# EAGLE design Aussensensor_v1.5 (EAGLE 6.6.0)
Assembly variants: AVR TH/P/L, AVR P/L, AVR L
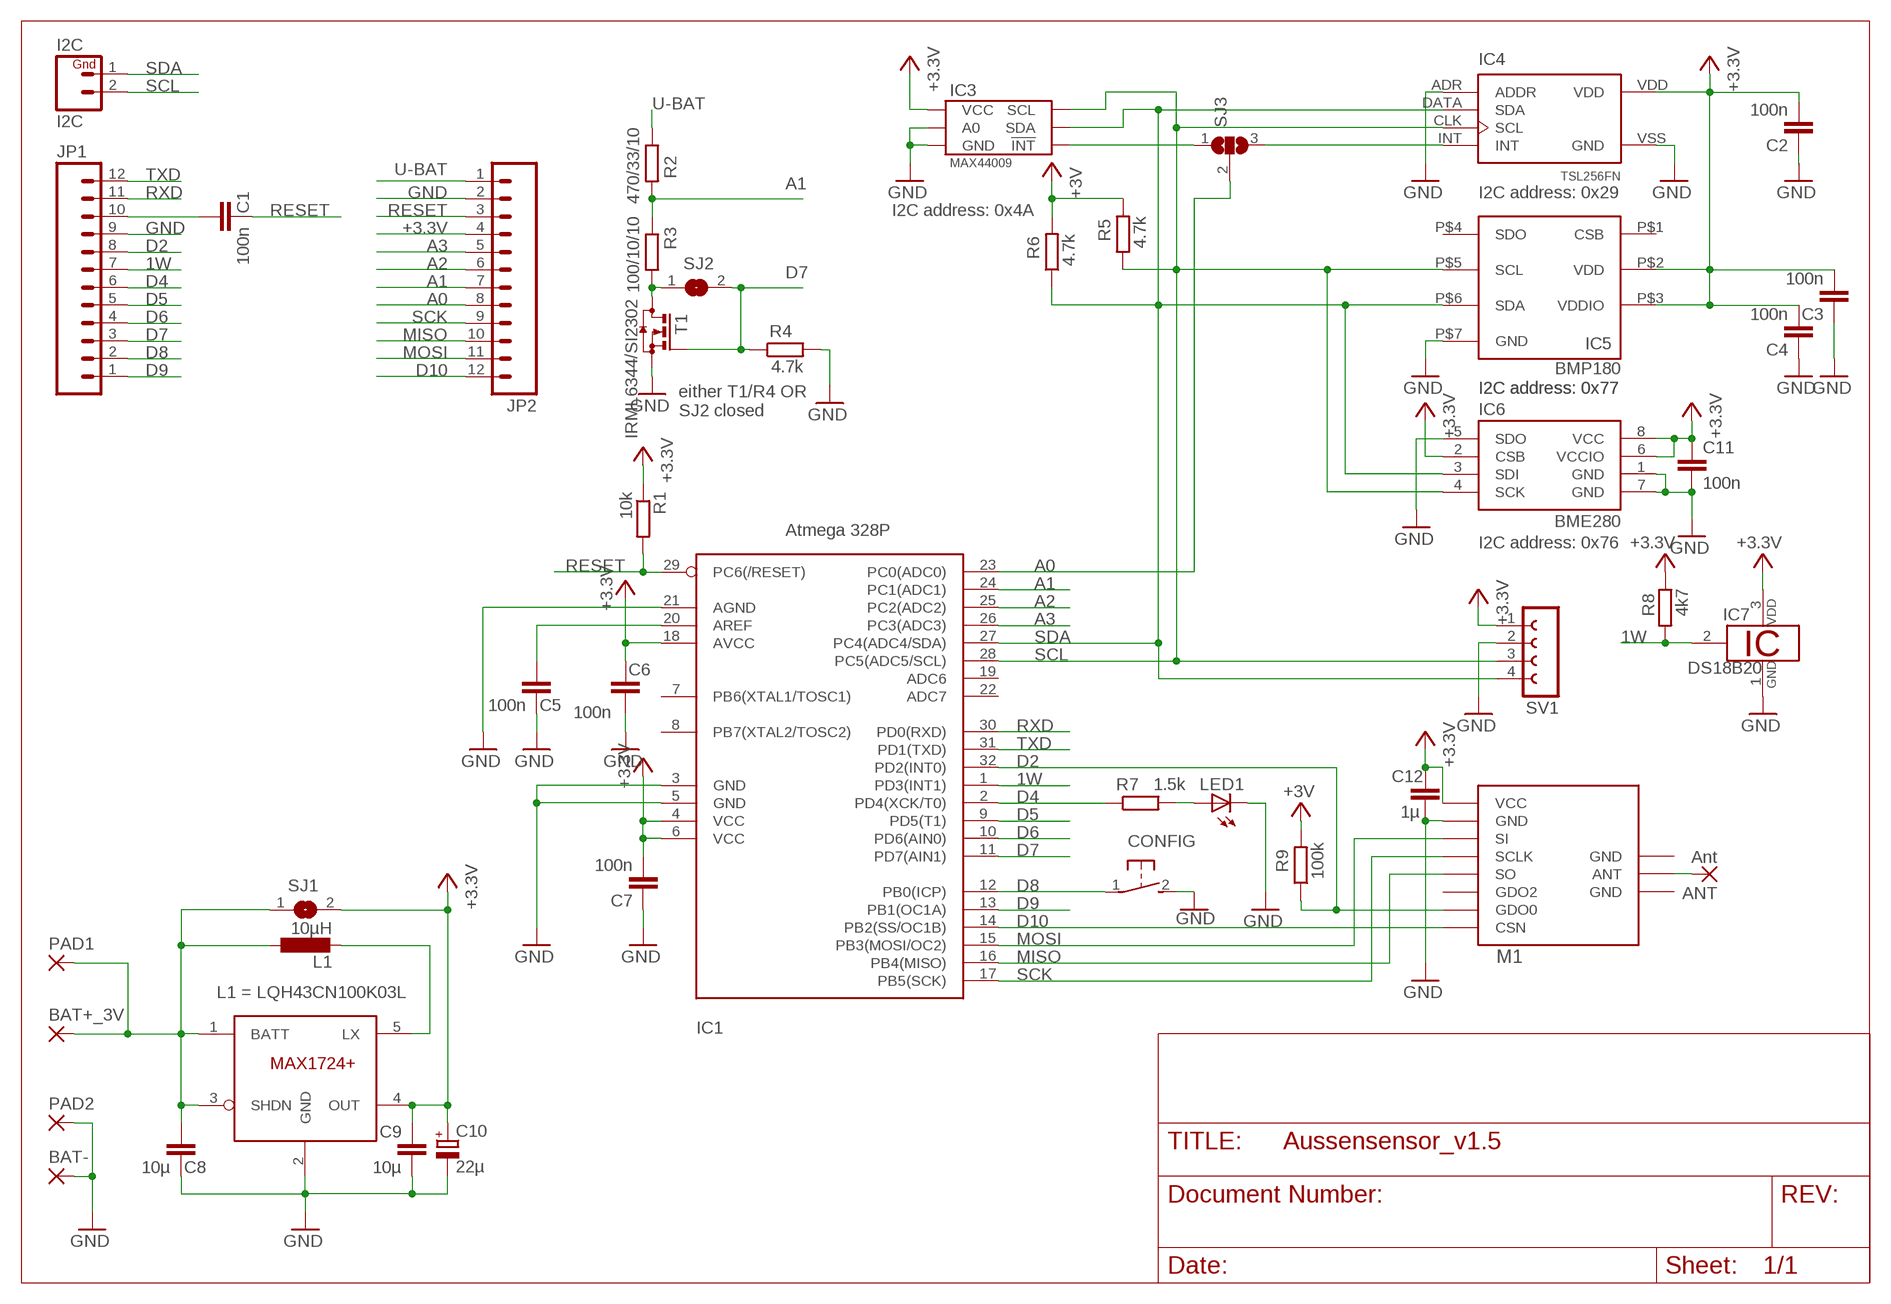
[diagram p0: schematic, sheet 1]

## Parts
ANT  Ant  1,6/0,8  [1,6/0,8]
BAT+_3V  1,6/0,9  [1,6/0,9]
BAT-  1,6/0,9  [1,6/0,9]
C1  100n  C-EUC0805  [C0805]
C2  100n  C-EUC0805  [C0805]
C3  100n  C-EUC0805  [C0805]  (not fitted in variant AVR L)
C4  100n  C-EUC0805  [C0805]  (not fitted in variant AVR L)
C5  100n  C-EUC0805  [C0805]
C6  100n  C-EUC0805  [C0805]
C7  100n  C-EUC0805  [C0805]
C8  10µ  C-EUC1206  [C1206]
C9  10µ  C-EUC1206  [C1206]
C10  22µ  CPOL-EUSMCA  [SMC_A]
C11  100n  C-EUC0805  [C0805]
C12  1µ  C-EUC0805  [C0805]
CONFIG  DTSM-3  [DTSM-3]
I2C  I2C  M02PTH  [1X02]  (not fitted in variant AVR TH/P/L)  (not fitted in variant AVR P/L)  (not fitted in variant AVR L)
IC1  Atmega 328P  MEGA8-AI  [TQFP32-08]
IC2  MAX1724  [SOT23-5L]
IC3  MAX44009  [UTDFN]
IC4  TSL256FN  [TSL256X_FN]
IC5  BMP180  [LGA-7]  (not fitted in variant AVR L)
IC6  BME280  [LGA_8PIN_25X25]
IC7  DS18B20  [TO92-]
JP1  M12PTH  [1X12]  (not fitted in variant AVR TH/P/L)  (not fitted in variant AVR P/L)  (not fitted in variant AVR L)
JP2  M12PTH  [1X12]  (not fitted in variant AVR TH/P/L)  (not fitted in variant AVR P/L)  (not fitted in variant AVR L)
L1  10µH  L-EUL4532P  [L4532P]
LED1  LEDCHIP-LED0805  [CHIP-LED0805]
M1  CC1101_WIRELES_MODULE  [CC1101_WIRELES_MODULE]
PAD1  SMD2  [SMD1,27-2,54]
PAD2  SMD2  [SMD1,27-2,54]
R1  10k  R-EU_M0805  [M0805]
R2  470/33/10  R-EU_M0805  [M0805]
R3  100/10/10  R-EU_M0805  [M0805]
R4  4.7k  R-EU_M0805  [M0805]
R5  4.7k  R-EU_M0805  [M0805]
R6  4.7k  R-EU_M0805  [M0805]
R7  1.5k  R-EU_M0805  [M0805]
R8  4k7  R-EU_M0805  [M0805]
R9  100k  R-EU_M0805  [M0805]
SJ1  SJ  [SJ]
SJ2  SJ  [SJ]
SJ3  SJ2W  [SJ_2]
SV1  FE04-1  [FE04-1]  (not fitted in variant AVR P/L)  (not fitted in variant AVR L)
T1  IRML6344/SI2302  BSS123  [SOT23]

## Nets
1W: IC1.1(PD3(INT1)) IC7.2 JP1.7 R8.2
+3.3V: C2.2 C3.2 C4.2 C6.2 C7.2 C9.2 C10.+ C11.1 C12.1 IC1.4(VCC) IC1.6(VCC) IC1.18(AVCC) IC2.4(OUT) IC3.1(VCC) IC4.VDD IC5.P$2(VDD) IC5.P$3(VDDIO) IC6.2(CSB) IC6.6(VCCIO) IC6.8(VCC) IC7.3 JP2.4 M1.VCC R1.1 R5.2 R6.2 R8.1 R9.2 SJ1.2 SV1.1 ; supply symbol labelled +3V
A0: IC1.23(PC0(ADC0)) JP2.8 SJ3.2
A1: IC1.24(PC1(ADC1)) JP2.7 R2.2 R3.1
A2: IC1.25(PC2(ADC2)) JP2.6
A3: IC1.26(PC3(ADC3)) JP2.5
D2: IC1.32(PD2(INT0)) JP1.8 M1.GDO0 R9.1
D4: IC1.2(PD4(XCK/T0)) JP1.6 R7.1
D5: IC1.9(PD5(T1)) JP1.5
D6: IC1.10(PD6(AIN0)) JP1.4
D7: IC1.11(PD7(AIN1)) JP1.3 R4.1 SJ2.2 T1.1(G)
D8: CONFIG.1 IC1.12(PB0(ICP)) JP1.2
D9: IC1.13(PB1(OC1A)) JP1.1
D10: IC1.14(PB2(SS/OC1B)) JP2.12 M1.CSN
GND: BAT-.1(P) C2.1 C3.1 C4.1 C5.1 C6.1 C7.1 C8.1 C9.1 C10.- C11.2 C12.2 CONFIG.2 IC1.3(GND) IC1.5(GND) IC1.21(AGND) IC2.2(GND) IC3.2(GND) IC3.3(A0) IC3.PAD(GND) IC4.ADR(ADDR) IC4.VSS(GND) IC5.P$7(GND) IC6.1(GND) IC6.5(SDO) IC6.7(GND) IC7.1 JP1.9 JP2.2 LED1.C M1.GND@1(GND) PAD2.1(P) R4.2 SV1.2 T1.2(S)
INT_MAX: IC3.4(!INT) SJ3.1
INT_TSL: IC4.INT SJ3.3
MISO: IC1.16(PB4(MISO)) JP2.10 M1.SO
MOSI: IC1.15(PB3(MOSI/OC2)) JP2.11 M1.SI
N$1: C1.2 JP1.10
N$2: IC2.5(LX) L1.2
N$3: R3.2 SJ2.1 T1.3(D)
N$4: LED1.A R7.2
N$5: ANT.1(P) M1.ANT
N$14: C5.2 IC1.20(AREF)
RESET: C1.1 IC1.29(PC6(/RESET)) JP2.3 R1.2
RXD: IC1.30(PD0(RXD)) JP1.11
SCK: IC1.17(PB5(SCK)) JP2.9 M1.SCLK
SCL: I2C.2 IC1.28(PC5(ADC5/SCL)) IC3.5(SCL) IC4.CLK(SCL) IC5.P$5(SCL) IC6.4(SCK) R5.1 SV1.3
SDA: I2C.1 IC1.27(PC4(ADC4/SDA)) IC3.6(SDA) IC4.DATA(SDA) IC5.P$6(SDA) IC6.3(SDI) R6.1 SV1.4
TXD: IC1.31(PD1(TXD)) JP1.12
U-BAT: BAT+_3V.1(P) C8.2 IC2.1(BATT) IC2.3(SHDN) JP2.1 L1.1 PAD1.1(P) R2.1 SJ1.1
Unconnected: IC1.7(PB6(XTAL1/TOSC1)) IC1.8(PB7(XTAL2/TOSC2)) IC1.19(ADC6) IC1.22(ADC7) IC5.P$1(CSB) IC5.P$4(SDO) M1.GDO2

## Notes on the sheet
- I2C address: 0x29
- I2C address: 0x4A
- either T1/R4 OR
  SJ2 closed
- I2C address: 0x77 | I2C address: 0x77
- I2C address: 0x76
- L1 = LQH43CN100K03L

## Power pins joined to a net without a drawn wire
GND: M1.GND@2(GND) M1.GND@3(GND)

## Library data of the parts
ANT = wirepad:1,6/0,8: THROUGH-HOLE PAD
BAT+_3V BAT- = wirepad:1,6/0,9: THROUGH-HOLE PAD
C1-C9 C11 C12 = rcl:C-EU: CAPACITOR, European symbol
C10 = rcl:CPOL-EU: POLARIZED CAPACITOR, European symbol
CONFIG = switch-tact:DTSM-3
I2C = SparkFun:M02: Header 2 Standard 2-pin 0.1" header. Use with straight break away headers (SKU : PRT-00116), right angle break away headers (PRT-00553), swiss pins (PRT-00743), machine pins (PRT-00117), and female headers (PRT-00115). Molex polarized connector foot print use with SKU : PRT-08233 with associated crimp pins and housings.
IC1 = atmel:MEGA8: MICROCONTROLLER 8 Kbytes FLASH 1 kbytes SRAM 512 bytes EEPROM USART 6-channel 10 bit ADC 2-channel 8 bit ADC
IC2 = MAX1724:MAX1724
IC3 = MAX44009_v6:MAX44009: Maxim Ambient Light Sensor
IC4 = TSL256x:TSL256*: Texas Instruments TSL2560 (SMBus), TSL2561 (I2C) Light-to-digital converter
IC5 = projecttree:BMP180
IC6 = bosch:BME280: Bosch BME280 humidity, temperature and pressure sensor.
IC7 = 1wire_v6:DS18B20: Programmable Resolution Digital Thermometer This chip provides a onewire thermosensor with approx. 0.5°C accuracy. A programmable over/undertemperure alarm is available. The precision can be set from 9..12 bits. Notes: Vdd must be applied for accurate measurements at low temperatures, as the parasite power circuit otherwise heats the sensor. If parasite power is used, Vdd has to be connected to GND. The DS1822 is a low-cost thermometer chip, the DS18S20 is similar to the DS18B20, but with 9 Bit precision only. Author: Jan Kandziora <jjj@gmx.de>
JP1 JP2 = SparkFun:M12: Header 12 Standard 12-pin 0.1" header. Use with straight break away headers (SKU : PRT-00116), right angle break away headers (PRT-00553), swiss pins (PRT-00743), machine pins (PRT-00117), and female headers (PRT-00115).
L1 = rcl:L-EU: INDUCTOR, European symbol
LED1 = led:LED: LED OSRAM: - CHIPLED LG R971, LG N971, LY N971, LG Q971, LY Q971, LO R971, LY R971 LH N974, LH R974 LS Q976, LO Q976, LY Q976 LO Q996 - Hyper CHIPLED LW Q18S LB Q993, LB Q99A, LB R99A - SideLED LS A670, LO A670, LY A670, LG A670, LP A670 LB A673, LV A673, LT A673, LW A673 LH A674 LY A675 LS A676, LA A676, LO A676, LY A676, LW A676 LS A679, LY A679, LG A679 - Hyper Micro SIDELED® LS Y876, LA Y876, LO Y876, LY Y876 LT Y87S - SmartLED LW L88C, LW L88S LB L89C, LB L89S, LG L890 LS L89K, LO L89K, LY L89K LS L896, LA L896, LO L896, LY L896 - TOPLED LS T670, LO T670, LY T670, LG T670, LP T670 LSG T670, LSP T670, LSY T670, LOP T670, LYG T670 LG T671, LOG T671, LSG T671 LB T673, LV T673, LT T673, LW T673 LH T674 LS T676, LA T676, LO T676, LY T676, LB T676, LH T676, LSB T676, LW T676 LB T67C, LV T67C, LT T67C, LS T67K, LO T67K, LY T67K, LW E67C LS E67B, LA E67B, LO E67B, LY E67B, LB E67C, LV E67C, LT E67C LW T67C LS T679, LY T679, LG T679 LS T770, LO T770, LY T770, LG T770, LP T770 LB T773, LV T773, LT T773, LW T773 LH T774 LS E675, LA E675, LY E675, LS T675 LS T776, LA T776, LO T776, LY T776, LB T776 LHGB T686 LT T68C, LB T68C - Hyper Mini TOPLED® LB M676 - Mini TOPLED Santana® LG M470 LS M47K, LO M47K, LY M47K Source: http://www.osram.convergy.de LUXEON: - LUMILED® LXK2-PW12-R00, LXK2-PW12-S00, LXK2-PW14-U00, LXK2-PW14-V00 LXK2-PM12-R00, LXK2-PM12-S00, LXK2-PM14-U00 LXK2-PE12-Q00, LXK2-PE12-R00, LXK2-PE12-S00, LXK2-PE14-T00, LXK2-PE14-U00 LXK2-PB12-K00, LXK2-PB12-L00, LXK2-PB12-M00, LXK2-PB14-N00, LXK2-PB14-P00, LXK2-PB14-Q00 LXK2-PR12-L00, LXK2-PR12-M00, LXK2-PR14-Q00, LXK2-PR14-R00 LXK2-PD12-Q00, LXK2-PD12-R00, LXK2-PD12-S00 LXK2-PH12-R00, LXK2-PH12-S00 LXK2-PL12-P00, LXK2-PL12-Q00, LXK2-PL12-R00 Source: www.luxeon.com KINGBRIGHT: KA-3528ASYC Source: www.kingbright.com
M1 = untitled:CC1101_WIRELES_MODULE
PAD1 PAD2 = wirepad:SMD2: SMD PAD
R1-R9 = rcl:R-EU_: RESISTOR, European symbol
SJ1 SJ2 = jumper:SJ: SMD solder JUMPER
SJ3 = jumper:SJ2W: SMD solder JUMPER
SV1 = untitled:FE04-1: FEMALE HEADER
T1 = transistor-small-signal:BSS123: N-CHANNEL MOS FET

## Net classes
1 vcc: width 0.254 mm

## Board
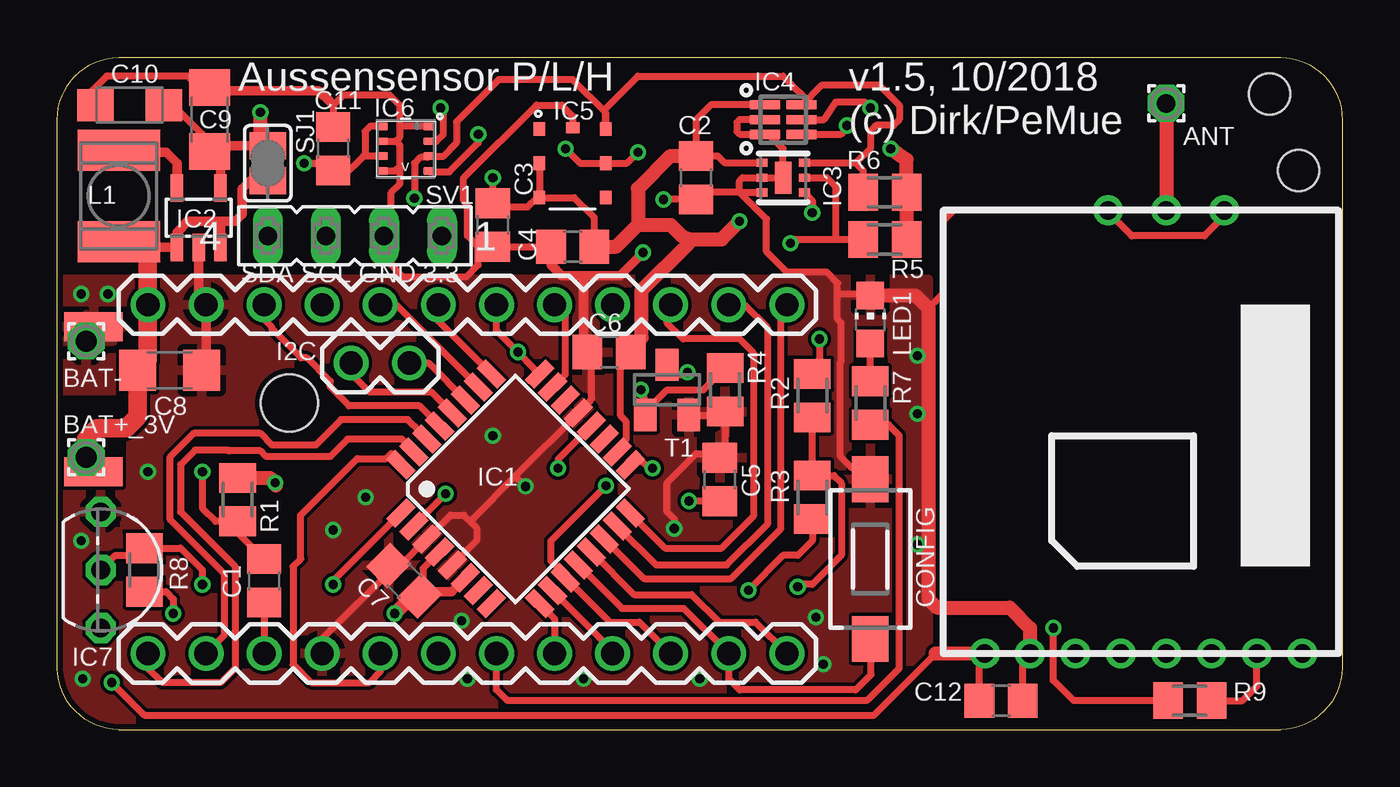
[diagram p1: board, top side]
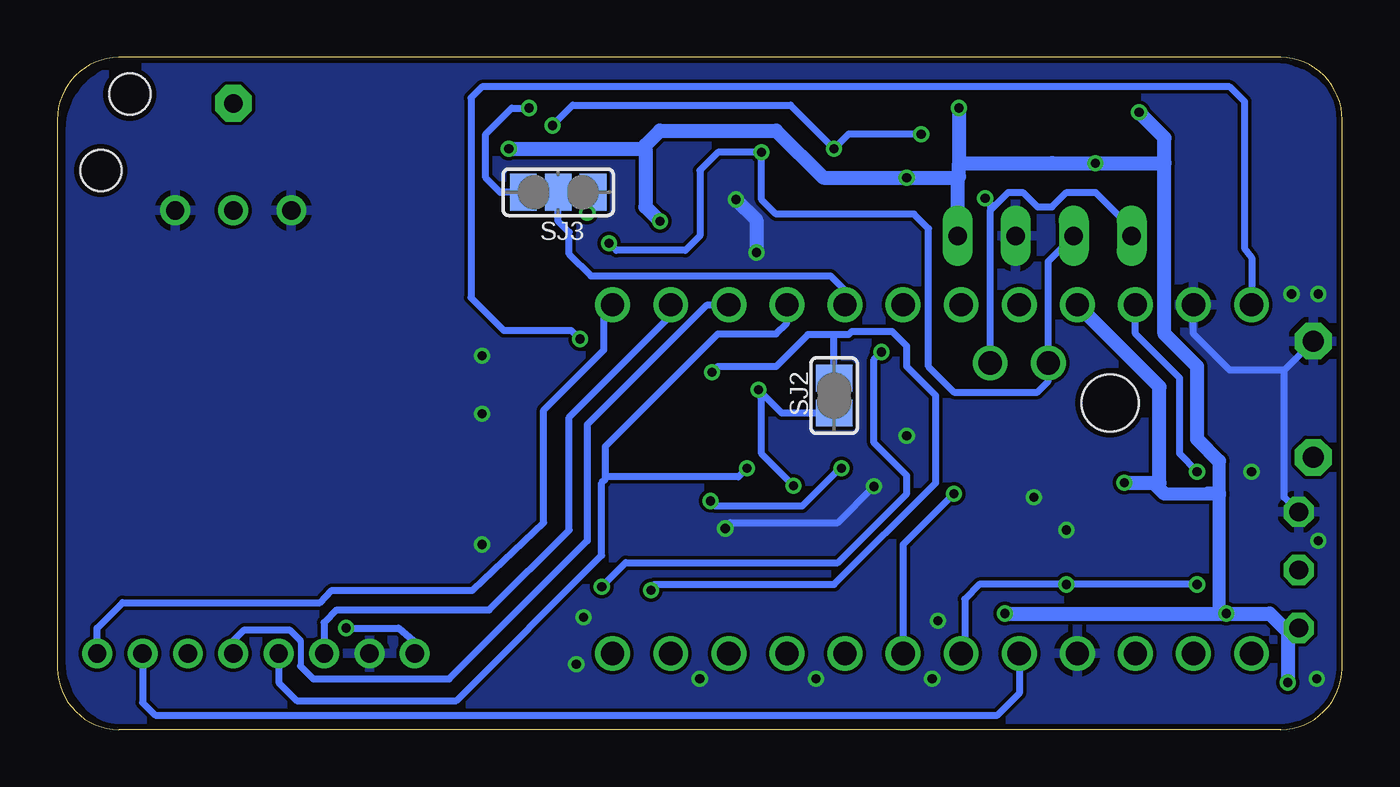
[diagram p2: board, bottom side, seen from below]

Size 56.2 x 29.4 mm. Coordinates in mm from the lower left corner, seen from the top.
Outline: 2.7,29.4 53.5,29.4 arc-88 56.2,26.67 56.2,2.7 arc-88 53.5,0 2.7,0 arc-88 0,2.7 0,26.67 arc-88 2.7,29.4
Copper layers (1*16): Top 0.035mm / dielectric 1.5mm / Bottom 0.035mm
Design rules "SeeedStudio_2layer_v1.0": minimum track width 6mil, minimum drill 12mil, track to track 6mil, track to pad 6mil, pad to pad 6mil, via to via 6mil, smd to smd 0mil, copper to edge 10mil, drill to drill 10mil, minimum pad ring 10mil, minimum via ring 6mil, stop-mask expansion 2mil, vias tented up to drill 100mil, thermal gap 10mil
Holes 1.8 mm at 54.29,24.45 53.02,27.78
Holes 2.5 mm at 10.16,14.29
tRestrict: area 0.2,14.1 to 2.9,14.6; area 2.1,12.1 to 3,12.5; area 3,16.8 to 3.3,17.9

### Footprints (pad centres in the part's own frame; a part is rotated, then mirrored left to right if it is on the bottom)
1,6/0,8 = drill 0.813 pad 1.6 octagon: 1 0,0
1,6/0,9 = drill 0.914 pad 1.6 octagon: 1 0,0
C0805 = smd 1.3 x 1.5: 1 -0.95,0; 2 0.95,0
C1206 = smd 1.6 x 1.8: 1 -1.4,0; 2 1.4,0
SMC_A = smd 1.6 x 1.4: + -1.5,0; - 1.5,0
DTSM-3 = smd 2 x 1.6: 1 -3.494,0; 2 3.494,0
1X02 = drill 1.016: 1 0,0; 2 2.54,0
TQFP32-08 = smd 1.27 x 0.559: 1 -4.293,2.8; 2 -4.293,2; 3 -4.293,1.2; 4 -4.293,0.4; 5 -4.293,-0.4; 6 -4.293,-1.2; 7 -4.293,-2; 8 -4.293,-2.8; 17 4.293,-2.8; 18 4.293,-2; 19 4.293,-1.2; 20 4.293,-0.4; 21 4.293,0.4; 22 4.293,1.2; 23 4.293,2; 24 4.293,2.8 | smd 0.559 x 1.27: 9 -2.8,-4.293; 10 -2,-4.293; 11 -1.2,-4.293; 12 -0.4,-4.293; 13 0.4,-4.293; 14 1.2,-4.293; 15 2,-4.293; 16 2.8,-4.293; 25 2.8,4.293; 26 2,4.293; 27 1.2,4.293; 28 0.4,4.293; 29 -0.4,4.293; 30 -1.2,4.293; 31 -2,4.293; 32 -2.8,4.293
SOT23-5L = smd 0.55 x 1.2: 1 -0.95,-1.3; 2 0,-1.3; 3 0.95,-1.3; 4 0.95,1.3; 5 -0.95,1.3
UTDFN = smd 0.48 x 0.36: 1 -0.925,0.65; 2 -0.925,0; 3 -0.925,-0.65; 4 0.925,-0.65; 5 0.925,0; 6 0.925,0.65 | smd 0.71 x 1.4: PAD 0,0
TSL256X_FN = smd 1.3 x 0.4: ADR -0.8,0; CLK 0.8,-0.65; DATA 0.8,0.65; INT 0.8,0; VDD -0.8,0.65; VSS -0.8,-0.65
LGA-7 = smd 0.6 x 0.5: P$1 1.5,1.45; P$2 0,1.45; P$3 -1.5,1.45; P$4 -1.5,-1.45; P$5 0,-1.45; P$6 1.5,-1.45 | smd 0.5 x 0.6: P$7 1.55,0
LGA_8PIN_25X25 = smd 0.5 x 0.35: 1 1.025,0.975; 2 1.025,0.325; 3 1.025,-0.325; 4 1.025,-0.975; 5 -1.025,-0.975; 6 -1.025,-0.325; 7 -1.025,0.325; 8 -1.025,0.975
TO92- = drill 0.813 octagon: 1 -2.54,0; 2 0,0; 3 2.54,0
1X12 = drill 1.016: 1 0,0; 2 2.54,0; 3 5.08,0; 4 7.62,0; 5 10.16,0; 6 12.7,0; 7 15.24,0; 8 17.78,0; 9 20.32,0; 10 22.86,0; 11 25.4,0; 12 27.94,0
L4532P = smd 1.8 x 3.6: 1 -2,0; 2 2,0
CHIP-LED0805 = smd 1.2 x 1.2: A 0,-1.05; C 0,1.05
CC1101_WIRELES_MODULE = drill 0.8: ANT 19.367,7.541; CSN 0,1.587; GDO0 0,3.572; GDO2 0,5.556; GND@1 0,13.494; GND@2 19.367,10.081; GND@3 19.367,5.001; SCLK 0,9.525; SI 0,11.509; SO 0,7.541; VCC 0,15.478
SMD1,27-2,54 = smd 1.27 x 2.54: 1 0,0
M0805 = smd 1.3 x 1.6: 1 -0.95,0; 2 0.95,0
SJ = smd 1.168 x 1.6: 1 -0.762,0; 2 0.762,0
SJ_2 = smd 1.168 x 1.6: 1 -1.524,0; 2 0,0; 3 1.524,0
FE04-1 = drill 0.813 long: 1 -5.08,0; 2 -2.54,0; 3 0,0; 4 2.54,0
SOT23 = smd 1 x 1.4: 1 -0.95,-1.1; 2 0.95,-1.1; 3 0,1.1

### Placement (x,y rotation side)
ANT  48.5,27.38 0 top
BAT+_3V  1.27,11.91 0 top
BAT-  1.27,16.99 0 top
C1  9.05,6.51 270 top
C2  27.94,24.13 90 top
C3  19.05,22.07 90 top
C4  22.54,21.11 0 top
C5  28.98,10.94 270 top
C6  24.13,16.51 0 top
C7  15.17,6.51 315 top
C8  4.92,15.72 180 top
C9  6.67,26.67 270 top
C10  3.17,27.3 180 top
C11  12.06,25.4 90 top
C12  41.27,1.27 0 top
CONFIG  35.56,7.46 90 top
I2C  15.4,16.03 180 top
IC1  20.04,10.53 45 top
IC2  6.19,22.38 0 top
IC3  31.75,24.13 0 top
IC4  31.75,26.67 0 top
IC5  22.54,24.77 90 top
IC6  15.24,25.4 0 top
IC7  1.91,6.99 270 top
JP1  31.91,3.33 180 top
JP2  3.97,18.57 0 top
L1  2.7,23.34 90 top
LED1  35.56,17.94 0 top
M1  56.04,3.33 90 top
PAD1  1.59,11.27 90 top
PAD2  1.59,17.62 90 top
R1  7.89,10.06 270 top
R2  33.02,14.61 270 top
R3  33.02,10.16 270 top
R4  29.21,14.86 270 top
R5  36.2,21.43 0 top
R6  36.2,23.5 0 top
R7  35.56,14.29 90 top
R8  3.81,6.99 90 top
R9  49.53,1.27 180 top
SJ1  9.21,24.77 90 top
SJ2  22.23,14.61 270 bottom
SJ3  34.29,23.5 180 bottom
SV1  11.75,21.59 180 top
T1  26.67,14.86 0 top

### Tracks (layer width: path | path; a pad name or v marks a point on that pad's centre or on a via)
1W  (via drill 0.4 pad 0.7)
  Top 0.305: IC7.2 2.54,7.62 3.5,7.62 R8.2 5.4,7.93 6.35,6.99 v6.35,6.35 | v12.06,6.35 12.06,6.51 IC1.1
  Bottom 0.305: v6.35,6.35 v12.06,6.35 15.88,6.35 16.51,5.71 16.51,3.49 JP1.7
+3.3V  (via drill 0.4 pad 0.7)
  Top 0.305: IC5.P$2 IC5.P$3 22.61,23.27 23.49,22.39 C4.2 | IC1.18 24.49,12.09 24.38,12.06 24.38,12.19 24.89,12.7 24.89,13.46 24.64,13.72 24.64,16.51 C6.2 25.27,16.85 | 16.44,6.03 C7.2 16,6.32 16,7.05 IC1.4 | 40.33,3.33 M1.VCC 40.33,3.1 C12.1 | v2.38,2.06 3.81,0.64 35.72,0.64 38.42,3.33 | IC6.6 13.39,25.07 | 13.39,25.07 12.45,24.13 12.38,24.13 C11.1 12.06,24.77 v10.79,24.77 | 13.39,25.07 13.46,25.15 13.46,26.16 13.68,26.38 IC6.8 | IC6.2 16.58,25.73 16.89,26.04 16.89,27.05 v16.76,27.18 | 8.89,25.84 SJ1.2 | R8.1 4.76,6.04 5.08,5.71 v5.08,5.08 | C10.+ 5.08,27.3 6.35,26.04 6.35,25.59 C9.2 | IC3.1 30.81,24.77 29.21,24.77 28.89,25.08 C2.2 27.94,26.67 28.59,27.32 IC4.VDD | C3.2 v19.05,24.13 19.05,22.86 20.57,22.86 20.95,23.24 | R9.2 44.45,1.27 43.56,2.16 v43.56,4.45
  Top 0.406: IC2.4 7.14,24.8 C9.2 6.92,25.53 SJ1.2 | IC1.6 17.24,6.03 16.44,6.03
  Top 0.61: 25.27,16.85 25.56,17.14 25.56,19.21 27.62,21.27 27.62,21.43 | R5.2 R6.2 37.15,24.92 v36.45,25.4 | 16,6.32 v14.76,5.08 | C4.2 24.45,21.11 25.4,22.07 | C2.2 26.83,25.08 25.4,23.65 25.4,22.07 | 25.4,22.07 26.83,22.07 27.3,21.59 27.62,21.43 | 27.62,21.43 29.05,21.43 v29.84,22.23 | R1.1 9.31,11.01 v9.53,10.79 9.56,10.67 | 8.89,25.84 v8.89,26.99 | 38.42,3.33 M1.VCC
  Bottom 0.305: IC7.3 2.22,4.45 2.38,4.29 | v43.56,4.45 41.27,4.45 40.64,3.89 M1.VCC
  Bottom 0.559: 5.4,11.75 5.4,10.32 | 7.78,10.32 5.87,10.32 | 5.4,10.29 5.4,5.08
  Bottom 0.61: v36.45,25.4 30.48,25.4 | 30.48,25.4 30.48,22.86 v29.84,22.23 | v14.76,5.08 5.4,5.08 v5.08,5.08 3.17,5.08 2.38,4.29 v2.38,2.06 | 7.78,24.77 7.78,17.3 6.35,15.88 6.35,12.7 5.4,11.75 | 7.78,24.77 7.78,25.88 v8.89,26.99 | 30.48,25.4 30.48,25.56 29.84,26.19 24.77,26.19 22.7,24.13 v19.05,24.13 16.83,24.13 | 16.83,24.13 16.76,24.19 16.76,24.77 | 16.76,24.77 v10.79,24.77 | 12.7,24.77 v10.79,24.77 | v10.79,24.77 7.78,24.77 | 16.83,24.13 SV1.1 | 7.78,10.32 8.26,10.79 v9.53,10.79 8,10.79 8,14.99 JP2.4 | v16.76,27.18 16.76,24.77 | 5.4,10.29 5.87,10.32 5.4,10.32 5.4,10.29
A0
  Top 0.305: IC1.23 22.23,15.54 22.23,18.1 JP2.8
  Bottom 0.305: JP2.8 21.75,19.21 22.38,19.84 32.86,19.84 33.81,20.8 33.81,21.75 34.29,22.23 SJ3.2
A1  (via drill 0.4 pad 0.7)
  Top 0.305: JP2.7 19.21,17.43 19.24,17.43 v20.16,16.51 20.8,15.84 IC1.24 | R2.2 R3.1 33.98,11.11 34.29,10.79 34.29,7.62 33.02,6.35 32.26,6.35 v32.38,6.25
  Bottom 0.305: v32.38,6.25 31.34,7.3 22.07,7.3 19.05,10.32 19.05,11.11 20.48,12.54 20.48,16.19 v20.16,16.51
A2
  Top 0.305: JP2.6 16.67,17.86 IC1.25 18.99,15.46
A3
  Top 0.305: JP2.5 14.82,18.57 IC1.26
D2
  Top 0.305: 10.64,7.46 10.32,7.14 10.32,2.86 11.11,2.06 13.65,2.06 14.13,2.54 JP1.8 | 10.67,7.49 10.64,7.46 | 10.64,7.46 10.64,9.37 13.12,11.85 14.39,11.85 14.61,12.06 IC1.32 | R9.1 51.83,1.27 52.47,1.91 M1.GDO0
  Bottom 0.305: JP1.8 14.13,1.59 15.08,0.64 51.91,0.64 52.47,1.19 M1.GDO0
D4  (via drill 0.4 pad 0.7)
  Top 0.305: IC1.2 15.91,9.24 v16.99,10.32 | JP1.6 19.21,1.75 19.68,1.27 35.4,1.27 36.83,2.7 36.83,12.86 36.35,13.34 R7.1
  Bottom 0.305: v16.99,10.32 19.21,8.1 JP1.6
D5
  Top 0.305: IC1.9 21.75,4.86 JP1.5
D6
  Top 0.305: IC1.10 24.29,3.45 JP1.4
D7  (via drill 0.4 pad 0.7)
  Top 0.305: JP1.3 25.46,4.7 24.17,4.7 IC1.11 22.23,6.73 21.59,7.37 21.59,8.26 v24,10.67 | v25.53,14.86 25.65,14.48 25.65,13.97 25.89,13.97 T1.1 25.72,13.65 25.65,13.72 25.65,13.84 26.67,14.86 28.26,14.86 R4.1
  Bottom 0.305: v24,10.67 25.4,12.06 25.4,14.48 v25.53,14.86 24.51,13.84 SJ2.2
D8
  Top 0.305: IC1.12 24.7,5.3 27.4,5.3 JP1.2 29.37,2.22 29.84,1.75 34.92,1.75 35.59,2.41 35.59,4.74 CONFIG.1
D9
  Top 0.305: IC1.13 25.23,5.91 27.75,5.91 28.96,4.7 30.54,4.7 JP1.1
D10
  Top 0.305: JP2.12 31.62,18.41 31.62,8.76 29.46,6.6 25.66,6.6 IC1.14
  Bottom 0.305: JP2.12 32.29,18.19 32.29,16.61 34.92,13.97 34.92,9.05 38.04,6.1 44.2,6.1 44.7,5.56 53.34,5.56 54.45,4.45 M1.CSN
GND  (via drill 0.4 pad 0.7)
  Top 0.254: 18.11,9.16 18.11,9.05 | CONFIG.2 34.77,11.43 | 35.5,19.05 LED1.C
  Top 0.305: v26.51,23.18 C2.1 28.25,23.5 29.84,23.5 | IC1.5 18.34,8.26 18.34,8.82 18.11,9.05 17.78,9.39 17.2,9.39 IC1.3 14.97,7.16 C7.1 | 20.03,11.08 IC1.21 23.29,14.34 23.37,14.48 23.37,16.32 C6.1 | 20.03,11.08 18.11,9.16 | C7.1 14.97,7.03 | JP1.9 11.59,3.97 14.81,7.19 C7.1 | IC5.P$7 22.54,26.83 22.07,27.3 20.95,27.3 17.78,24.13 17.78,23.11 17.94,22.95 17.94,21.59 18.41,21.12 | C4.1 20.64,21.12 C3.1 18.41,21.12 | v20.48,10.64 | v20.48,10.64 20.03,11.08 | 34.77,11.43 34.26,11.94 34.26,16.1 34.29,16.13 34.29,17.78 34.13,17.94 34.13,19.05 | 34.13,19.05 34.13,19.53 33.66,20 31.91,20 31.02,20.89 31.02,22.32 29.84,23.5 | 34.13,19.05 35.5,19.05 | M1.GND@3 51.04,22.46 50.16,21.59 46.99,21.59 45.96,22.62 M1.GND@2 39.21,22.7 38.73,22.23 38.73,19.05 38.1,18.41 | 11.91,27.46 12.06,27.3 | 12.06,27.3 C11.2 | IC6.7 14.8,25.73 | 14.8,25.73 14.99,25.91 14.99,26.42 | 14.99,26.42 14.99,27.28 14.53,27.74 12.5,27.74 12.06,27.3 | IC6.5 14.52,24.43 14.53,24.43 14.78,24.43 14.99,24.64 | 14.99,24.64 14.99,25.54 14.8,25.73 | IC6.1 15.03,26.38 14.99,26.42 | C9.1 6.22,28.07 5.71,28.57 2.16,28.57 1.52,27.94 1.52,27.71 C10.- | C12.2 42.23,3.01 M1.GND@1 | 14.99,24.64 14.99,23.88 14.61,23.5 14.61,22.86 14.29,22.54 SV1.2 14.61,21.27 14.61,20.32 15.11,19.81 17.91,19.81 18.41,20.32 18.41,21.12 | 29.84,23.5 30.81,23.5 IC3.3 | 29.84,23.5 29.84,24 29.97,24.13 IC3.2 IC3.PAD 31.75,25.4 31.13,26.02 IC4.VSS 30.93,26.04 29.84,26.04 29.72,26.16 29.72,26.54 29.84,26.67 IC4.ADR | T1.2 27.77,13.65 27.83,13.72 28.96,13.72 R4.2 29.21,12.12 | v26.99,8.79 26.99,9.21 26.67,9.53 26.67,10.79 27.94,12.06 28.8,12.06 C5.1 | C5.1 29.03,11.89 29.21,12.06 29.21,12.12
  Top 0.305: 29.21,12.12 C5.1
  Top 0.406: 23.02,16.51 23.02,19.84 | C4.1 21.59,20.48 21.59,20.32 22.07,19.84 23.02,19.84 | v25.62,20.86 24.61,19.84 23.02,19.84 | IC2.2 6.19,18.89 JP2.2 6.51,15.9 C8.1 6.35,15.69 | C9.1 arc90 6.8,27.94 11.43,27.94 11.91,27.46
  Top 0.61: LED1.C 37.53,18.99 38.1,18.41 38.1,5.71 38.48,5.33 41.66,5.33 42.55,4.45 M1.GND@1
  Top 0.813: BAT-.1 1.27,17.46 PAD2.1
  Bottom 0.305: v26.99,8.79 26.92,8.89 26.77,9.05 22.07,9.05 v20.48,10.64 | BAT-.1 2.54,15.72 | 2.54,15.72 4.92,15.72 6.51,17.3 JP2.2 | IC7.1 2.54,10.16 2.54,15.72
  Bottom 0.61: v26.51,23.18 25.62,22.29 v25.62,20.86
  other vias: 3.97,11.27 12.06,8.73 19.05,12.86 33.5,2.86 28.1,2.22 23.02,2.22 17.68,4.76 13.49,10.16 1.05,8.26 1.11,2.22 33.18,4.92 2.22,19.05 1.05,19.05 17.94,2.22 37.62,16.35 37.62,13.81 37.62,8.1
  pour Bottom: 52.88,0.25 3,0.25 arc-90 0.25,3 0.25,26.21 arc-90 3,28.96 52.88,28.96 arc-90 55.63,26.21 55.63,3 arc-90
  pour Top: 38.1,0.25 3,0.25 arc-90 0.25,3 0.25,19.68 38.1,19.68
INT_MAX  (via drill 0.4 pad 0.7)
  Top 0.305: IC3.4 33.02,23.14 v33.02,22.61
  Bottom 0.305: v33.02,22.61 32.77,22.86 SJ3.1
INT_TSL  (via drill 0.4 pad 0.7)
  Top 0.305: v35.56,27.18 35.31,27.43 34.04,27.43 33.53,26.67 IC4.INT
  Bottom 0.305: SJ3.3 36.83,23.5 37.47,24.13 37.47,26.04 36.32,27.18 v35.56,27.18
MISO
  Top 0.305: JP2.10 26.67,18.41 26.67,17.78 27.37,17.08 29.84,17.08 30.45,16.48 30.45,9.34 29.05,7.94 26.59,7.94 IC1.16
  Bottom 0.254: 45.56,3.89 45.56,2.78
  Bottom 0.305: JP2.10 27.78,18.57 33.02,13.34 33.02,8.26 39.05,2.22 45.01,2.22 45.56,2.78 | M1.SO 48.5,3.89 48.02,4.37 46.04,4.37 45.56,3.89
MOSI
  Top 0.305: JP2.11 29.69,18.57 29.72,18.54 30.1,18.54 31.05,17.59 31.05,8.98 29.27,7.21 26.19,7.21 IC1.15
  Bottom 0.305: M1.SI 44.53,4.68 43.97,5.24 37.31,5.24 33.81,8.73 33.81,13.65 29.37,18.1 JP2.11
N$1
  Top 0.305: C1.2 JP1.10
N$2
  Top 0.406: IC2.5 5.24,24.76 4.76,25.24 2.79,25.24 L1.2
N$3  (via drill 0.4 pad 0.7)
  Top 0.305: v27.56,15.62 27.43,15.49 26.84,15.49 T1.3 | R3.2 33.02,8.26 32.38,7.62 31.75,7.62 v30.23,6.1
  Bottom 0.305: v30.23,6.1 30.35,6.1 30.1,6.35 22.23,6.35 17.78,10.79 17.78,14.61 19.05,15.88 19.05,16.76 19.68,17.4 21.46,17.4 21.59,17.27 22.23,17.27 | 22.23,17.27 23.37,17.27 24.77,15.88 27.3,15.88 v27.56,15.62 | SJ2.1 22.23,17.27
N$4
  Top 0.305: R7.2 LED1.A
N$5
  Top 0.61: ANT.1 M1.ANT
N$14  (via drill 0.4 pad 0.7)
  Top 0.305: IC1.20 21.91,11.83 v21.91,11.43 | 27.64,9.99 v27.62,10 28.96,10 C5.2
  Bottom 0.305: v21.91,11.43 22.07,11.27 21.84,11.43 21.97,11.43 23.62,9.78 27.43,9.78 v27.62,10
RESET  (via drill 0.4 pad 0.7)
  Top 0.305: JP2.3 9.05,17.94 9.4,17.59 9.4,17.53 10.67,16.26 10.92,16.26 11.94,15.24 11.94,14.99 12.76,14.16 15.84,14.16 IC1.29 | v6.35,11.27 6.35,9.68 6.92,9.11 R1.2 7.89,8.62 C1.1
  Bottom 0.305: v6.35,11.27 7.11,12.06 7.11,15.37 9.05,17.3 JP2.3
RXD
  Top 0.305: JP1.11 7.3,4.13 7.3,6.83 4.92,9.21 4.92,11.91 5.97,12.95 8.89,12.95 9.4,12.45 11.3,12.45 12.41,13.56 15.34,13.56 15.84,13.05 15.75,12.95 16.16,12.73 IC1.30
SCK  (via drill 0.4 pad 0.7)
  Top 0.305: IC1.17 25.39,11.9 25.88,11.43 v26.04,11.43
  Bottom 0.305: 32.23,11.05 32.23,10.95 32.38,10.79 32.38,7.62 38.73,1.27 45.72,1.27 46.51,2.06 M1.SCLK | 32.23,11.05 32.23,12.38 27.3,17.3 24.77,17.3 24.29,17.78 JP2.9 | v26.04,11.43 26.42,11.05 32.23,11.05
SCL  (via drill 0.4 pad 0.7)
  Top 0.305: 34.04,21.43 32.23,21.43 v32.07,21.27 | 34.04,21.43 R5.1 | v25.4,25.24 24.92,24.77 IC5.P$5 22.86,24.77 v22.23,25.4 | IC1.28 16.37,14.76 13.65,14.76 12.86,15.56 I2C.2 | IC6.4 16.31,24.38 17.14,24.38 18.41,25.65 v18.41,26.04 | IC3.5 33.66,24.13 34.04,23.75 34.04,21.43 | 32.56,26.04 33.02,26.04 | 33.02,26.04 34.29,26.04 34.54,26.29 v34.54,26.42 | IC4.CLK 33.02,26.02 33.02,26.04
  Bottom 0.305: v32.07,21.27 31.75,20.95 28.73,20.95 28.1,21.59 28.1,24.45 27.3,25.24 v25.4,25.24 25.4,23.18 24.77,22.54 18.73,22.54 18.1,21.91 18.1,15.88 16.99,14.76 13.34,14.76 12.86,15.24 I2C.2 12.86,20.48 SV1.3 | v18.41,26.04 21.59,26.04 v22.23,25.4 24.13,27.3 33.66,27.3 v34.54,26.42
SDA  (via drill 0.4 pad 0.7)
  Top 0.305: R6.1 35.24,24.45 34.91,24.78 | I2C.1 16.23,16.03 IC1.27 | v15.62,23.24 15.62,24.77 15.88,25.02 16.19,25.02 IC6.3 16.9,25.07 17.46,25.65 17.46,26.57 19.3,28.42 22.54,28.42 23.99,26.97 IC5.P$6 24,26.29 23.98,26.31 23.98,27.15 25.4,28.57 31.75,28.57 33.02,27.3 | 33.02,27.3 32.56,27.3 33.45,28.19 35.94,28.19 36.83,27.3 36.83,26.67 36.58,26.42 35.81,26.42 35.56,26.16 35.56,25.4 34.94,24.78 34.91,24.78 | IC3.6 34.91,24.78 | IC4.DATA 33.02,27.32 33.02,27.3
  Bottom 0.305: I2C.1 15.4,22.7 | 15.4,22.7 14.61,23.5 13.97,23.5 13.34,22.86 12.7,22.86 12.06,23.5 10.79,23.5 9.53,22.23 9.53,21.91 SV1.4 | v15.62,23.24 15.4,23.02 15.4,22.7
TXD
  Top 0.305: JP1.12 3.97,2.7 4.6,2.06 7.14,2.06 7.78,2.7 7.78,7.14 5.4,9.53 5.4,11.59 6.03,12.22 7.46,12.22 7.52,12.19 8.89,12.19 9.14,11.94 11.94,11.94 12.7,12.7 15.08,12.7 15.59,12.19 IC1.31
U-BAT  (via drill 0.4 pad 0.7)
  Top 0.305: v33.34,17.08 33.34,16.19 33.02,15.88 33.18,15.65 R2.1
  Top 0.406: L1.1 2.95,21.08 3.65,21.08 3.81,21.08 IC2.1 5.24,21.75 5.71,22.23 7.14,22.23 | 7.14,22.23 7.78,22.23 8.1,22.54 8.1,23.65 8.41,23.97 9.18,23.97 SJ1.1 | IC2.3 7.14,22.22 7.14,22.23
  Top 0.61: 3.97,20.93 3.81,21.08
  Top 0.813: 3.65,21.08 3.97,20.77 JP2.1 3.97,16.16 C8.2 3.52,13.68 3.02,13.18 1.75,13.18 1.27,12.7 BAT+_3V.1 1.27,11.59 PAD1.1
  Bottom 0.305: v33.34,17.08 33.72,17.46 36.67,17.46 38.1,18.89 38.1,27.62 37.62,28.1 4.92,28.1 4.29,27.46 4.29,21.05 3.97,20.64 JP2.1

### Text on the board
tNames: Aussensensor P/L/H | v1.5, 10/2018 / (c) Dirk/PeMue | SDA SCL GND 3.3